# Altium project Gator Stream Transmitter.PrjPCB
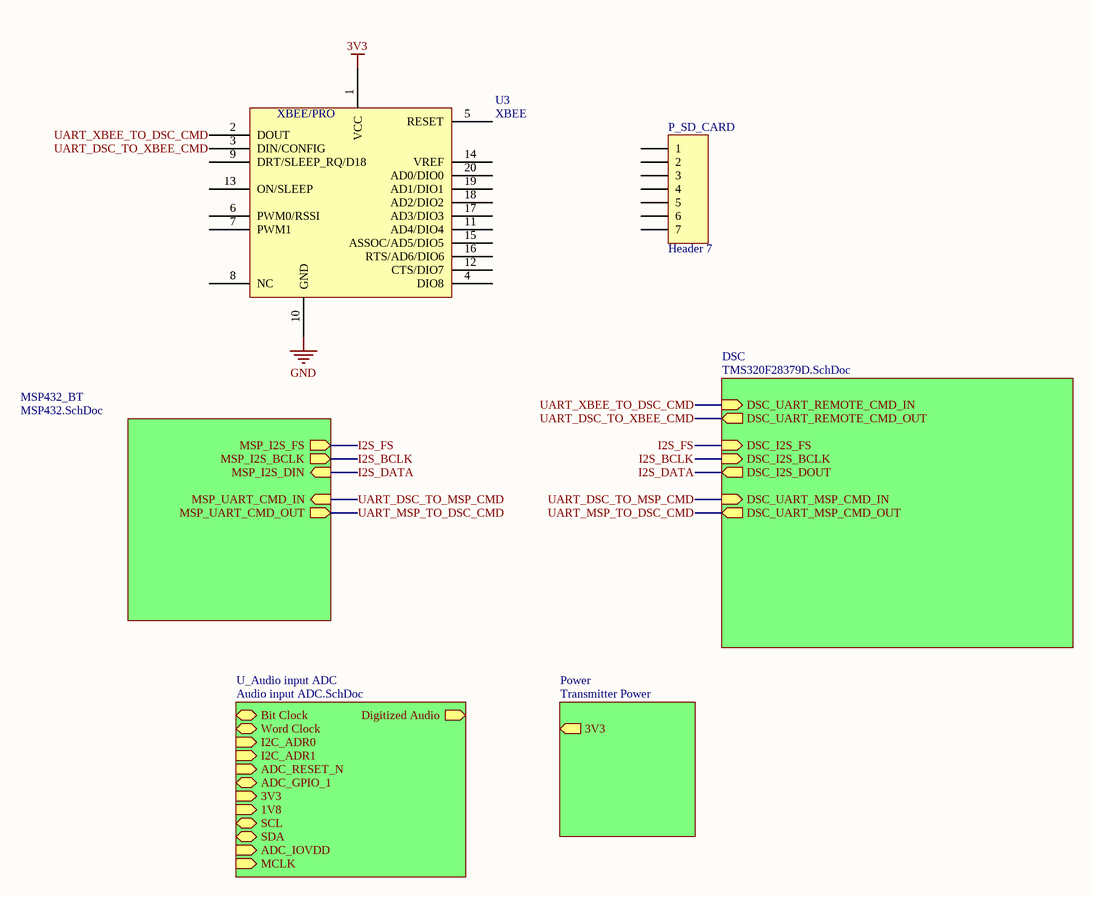
[diagram p0: Gator Stream Transmitter Sheet.SchDoc]
3 sheets, 18 parts. Net scope: hierarchical (ports join the sheet entries above them; power ports are global).
Board file: Gator Stream Transmitter.PcbDoc
Sheets:
  Gator Stream Transmitter Sheet.SchDoc
    MSP432_BT = MSP432.SchDoc
    DSC = TMS320F28379D.SchDoc

## Sheet Gator Stream Transmitter Sheet.SchDoc
size Letter

### Parts
P_SD_CARD  Header 7  [HDR1X7]
U3  XBEE  [XBEE/PRO]

### Sub-sheets
DSC = TMS320F28379D.SchDoc: DSC_I2S_FS (in), DSC_UART_MSP_CMD_IN (in), DSC_UART_MSP_CMD_OUT (out), DSC_I2S_DOUT (out), DSC_I2S_BCLK (in), DSC_UART_REMOTE_CMD_IN (in), DSC_UART_REMOTE_CMD_OUT (out)
MSP432_BT = MSP432.SchDoc: MSP_I2S_FS (out), MSP_I2S_DIN (in), MSP_UART_CMD_OUT (out), MSP_UART_CMD_IN (in), MSP_I2S_BCLK (out)
Power = Transmitter Power (file not in this document): 3V3 (out)
U_Audio input ADC = Audio input ADC.SchDoc (file not in this document): Digitized Audio (out), Bit Clock (bidir), Word Clock (bidir), I2C_ADR0 (in), I2C_ADR1 (in), ADC_RESET_N (in), ADC_GPIO_1 (bidir), 3V3 (in), 1V8 (in), SCL (bidir), SDA (bidir), ADC_IOVDD (in), MCLK (in)

### Nets
3V3: U3.1(VCC)
GND: U3.10(GND)
I2S_BCLK: sheet MSP432_BT/MSP_I2S_BCLK, sheet DSC/DSC_I2S_BCLK  [project net BT_I2S_BCLK]
I2S_DATA: sheet MSP432_BT/MSP_I2S_DIN, sheet DSC/DSC_I2S_DOUT  [project net BT_I2S_DIN]
I2S_FS: sheet MSP432_BT/MSP_I2S_FS, sheet DSC/DSC_I2S_FS  [project net BT_I2S_FS]
UART_DSC_TO_MSP_CMD: sheet MSP432_BT/MSP_UART_CMD_IN, sheet DSC/DSC_UART_MSP_CMD_IN  [project net UART_DSC_MSP_OUT]
UART_DSC_TO_XBEE_CMD: U3.3(DIN/CONFIG) ; sheet DSC/DSC_UART_REMOTE_CMD_OUT
UART_MSP_TO_DSC_CMD: sheet MSP432_BT/MSP_UART_CMD_OUT, sheet DSC/DSC_UART_MSP_CMD_OUT  [project net UART_DSC_MSP_IN]
UART_XBEE_TO_DSC_CMD: U3.2(DOUT) ; sheet DSC/DSC_UART_REMOTE_CMD_IN

Not connected (* = marked no-connect by the designer): P_SD_CARD 1 2 3 4 5 6 7; U3 4(DIO8) 5(RESET) 6(PWM0/RSSI) 7(PWM1) 8(NC) 9(DRT/SLEEP_RQ/D18) 11(AD4/DIO4) 12(CTS/DIO7) 13(ON/SLEEP) 14(VREF) 15(ASSOC/AD5/DIO5) 16(RTS/AD6/DIO6) 17(AD3/DIO3) 18(AD2/DIO2) 19(AD1/DIO1) 20(AD0/DIO0)

### Notes on the sheet
- (in symbol XBEE) XBEE/PRO

### Library data of the parts
P_SD_CARD = Header 7: Header, 7-Pin; LatestRevisionDate: 17-Jul-2002; LatestRevisionNote: Re-released for DXP Platform.; Publisher: Altium Limited

## Sheet MSP432.SchDoc
size Letter
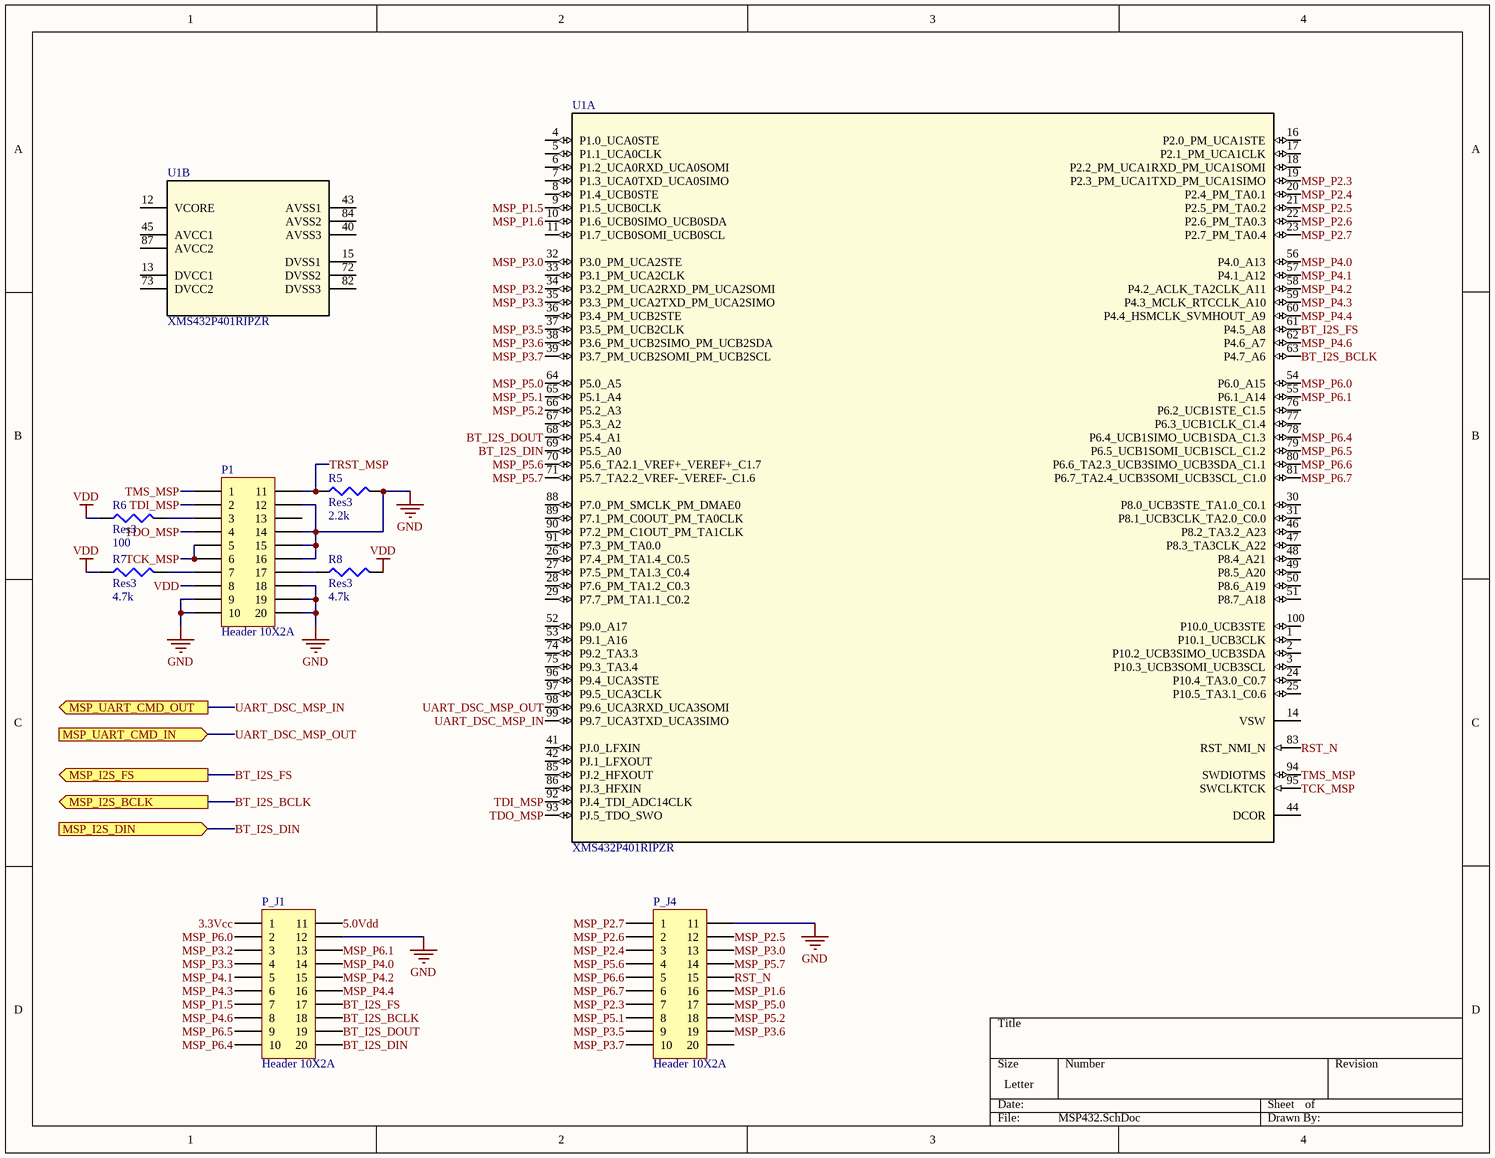
[diagram p1: MSP432.SchDoc]

### Parts
P1  Header 10X2A  [HDR2X10_CEN]
P_J1  Header 10X2A  [HDR2X10_CEN]
P_J4  Header 10X2A  [HDR2X10_CEN]
R5  Res3  value 2.2k  [J1-0603]
R6  Res3  value 100  [J1-0603]
R7  Res3  value 4.7k  [J1-0603]
R8  Res3  value 4.7k  [J1-0603]
U1  XMS432P401RIPZR  [PZ0100A_N]  (parts A,B of 2)

### Ports
MSP_I2S_BCLK (out), MSP_I2S_DIN (in), MSP_I2S_FS (out), MSP_UART_CMD_IN (in), MSP_UART_CMD_OUT (out)

### Nets
GND: P1.9 P1.10 P1.12 P1.14 P1.15 P1.16 P1.18 P1.19 P1.20 P_J1.12 P_J4.11 R5.2
VDD: P1.8 R6.1 R7.1 R8.2
3.3Vcc: P_J1.1
5.0Vdd: P_J1.11
BT_I2S_BCLK: P_J1.18 U1.63(P4.7_A6) ; port MSP_I2S_BCLK
BT_I2S_DIN: P_J1.20 U1.69(P5.5_A0) ; port MSP_I2S_DIN
BT_I2S_DOUT: P_J1.19 U1.68(P5.4_A1)
BT_I2S_FS: P_J1.17 U1.61(P4.5_A8) ; port MSP_I2S_FS
MSP_P1.5: P_J1.7 U1.9(P1.5_UCB0CLK)
MSP_P1.6: P_J4.16 U1.10(P1.6_UCB0SIMO_UCB0SDA)
MSP_P2.3: P_J4.7 U1.19(P2.3_PM_UCA1TXD_PM_UCA1SIMO)
MSP_P2.4: P_J4.3 U1.20(P2.4_PM_TA0.1)
MSP_P2.5: P_J4.12 U1.21(P2.5_PM_TA0.2)
MSP_P2.6: P_J4.2 U1.22(P2.6_PM_TA0.3)
MSP_P2.7: P_J4.1 U1.23(P2.7_PM_TA0.4)
MSP_P3.0: P_J4.13 U1.32(P3.0_PM_UCA2STE)
MSP_P3.2: P_J1.3 U1.34(P3.2_PM_UCA2RXD_PM_UCA2SOMI)
MSP_P3.3: P_J1.4 U1.35(P3.3_PM_UCA2TXD_PM_UCA2SIMO)
MSP_P3.5: P_J4.9 U1.37(P3.5_PM_UCB2CLK)
MSP_P3.6: P_J4.19 U1.38(P3.6_PM_UCB2SIMO_PM_UCB2SDA)
MSP_P3.7: P_J4.10 U1.39(P3.7_PM_UCB2SOMI_PM_UCB2SCL)
MSP_P4.0: P_J1.14 U1.56(P4.0_A13)
MSP_P4.1: P_J1.5 U1.57(P4.1_A12)
MSP_P4.2: P_J1.15 U1.58(P4.2_ACLK_TA2CLK_A11)
MSP_P4.3: P_J1.6 U1.59(P4.3_MCLK_RTCCLK_A10)
MSP_P4.4: P_J1.16 U1.60(P4.4_HSMCLK_SVMHOUT_A9)
MSP_P4.6: P_J1.8 U1.62(P4.6_A7)
MSP_P5.0: P_J4.17 U1.64(P5.0_A5)
MSP_P5.1: P_J4.8 U1.65(P5.1_A4)
MSP_P5.2: P_J4.18 U1.66(P5.2_A3)
MSP_P5.6: P_J4.4 U1.70(P5.6_TA2.1_VREF+_VEREF+_C1.7)
MSP_P5.7: P_J4.14 U1.71(P5.7_TA2.2_VREF-_VEREF-_C1.6)
MSP_P6.0: P_J1.2 U1.54(P6.0_A15)
MSP_P6.1: P_J1.13 U1.55(P6.1_A14)
MSP_P6.4: P_J1.10 U1.78(P6.4_UCB1SIMO_UCB1SDA_C1.3)
MSP_P6.5: P_J1.9 U1.79(P6.5_UCB1SOMI_UCB1SCL_C1.2)
MSP_P6.6: P_J4.5 U1.80(P6.6_TA2.3_UCB3SIMO_UCB3SDA_C1.1)
MSP_P6.7: P_J4.6 U1.81(P6.7_TA2.4_UCB3SOMI_UCB3SCL_C1.0)
RST_N: P_J4.15 U1.83(RST_NMI_N)
TCK_MSP: P1.5 P1.6 U1.95(SWCLKTCK)
TDI_MSP: P1.2 U1.92(PJ.4_TDI_ADC14CLK)
TDO_MSP: P1.4 U1.93(PJ.5_TDO_SWO)
TMS_MSP: P1.1 U1.94(SWDIOTMS)
TRST_MSP: P1.11 R5.1
UART_DSC_MSP_IN: U1.99(P9.7_UCA3TXD_UCA3SIMO) ; port MSP_UART_CMD_OUT
UART_DSC_MSP_OUT: U1.98(P9.6_UCA3RXD_UCA3SOMI) ; port MSP_UART_CMD_IN
NetP1_3: P1.3 R6.2
NetP1_7: P1.7 R7.2
NetP1_17: P1.17 R8.1

Not connected (* = marked no-connect by the designer): P1 13; P_J4 20; U1 1(P10.1_UCB3CLK) 2(P10.2_UCB3SIMO_UCB3SDA) 3(P10.3_UCB3SOMI_UCB3SCL) 4(P1.0_UCA0STE) 5(P1.1_UCA0CLK) 6(P1.2_UCA0RXD_UCA0SOMI) 7(P1.3_UCA0TXD_UCA0SIMO) 8(P1.4_UCB0STE) 11(P1.7_UCB0SOMI_UCB0SCL) 12(VCORE) 13(DVCC1) 14(VSW) 15(DVSS1) 16(P2.0_PM_UCA1STE) 17(P2.1_PM_UCA1CLK) 18(P2.2_PM_UCA1RXD_PM_UCA1SOMI) 24(P10.4_TA3.0_C0.7) 25(P10.5_TA3.1_C0.6) 26(P7.4_PM_TA1.4_C0.5) 27(P7.5_PM_TA1.3_C0.4) 28(P7.6_PM_TA1.2_C0.3) 29(P7.7_PM_TA1.1_C0.2) 30(P8.0_UCB3STE_TA1.0_C0.1) 31(P8.1_UCB3CLK_TA2.0_C0.0) 33(P3.1_PM_UCA2CLK) 36(P3.4_PM_UCB2STE) 40(AVSS3) 41(PJ.0_LFXIN) 42(PJ.1_LFXOUT) 43(AVSS1) 44(DCOR) 45(AVCC1) 46(P8.2_TA3.2_A23) 47(P8.3_TA3CLK_A22) 48(P8.4_A21) 49(P8.5_A20) 50(P8.6_A19) 51(P8.7_A18) 52(P9.0_A17) 53(P9.1_A16) 67(P5.3_A2) 72(DVSS2) 73(DVCC2) 74(P9.2_TA3.3) 75(P9.3_TA3.4) 76(P6.2_UCB1STE_C1.5) 77(P6.3_UCB1CLK_C1.4) 82(DVSS3) 84(AVSS2) 85(PJ.2_HFXOUT) 86(PJ.3_HFXIN) 87(AVCC2) 88(P7.0_PM_SMCLK_PM_DMAE0) 89(P7.1_PM_C0OUT_PM_TA0CLK) 90(P7.2_PM_C1OUT_PM_TA1CLK) 91(P7.3_PM_TA0.0) 96(P9.4_UCA3STE) 97(P9.5_UCA3CLK) 100(P10.0_UCB3STE)

### Library data of the parts
P1 P_J1 P_J4 = Header 10X2A: Header, 10-Pin, Dual row; LatestRevisionDate: 17-Jul-2002; LatestRevisionNote: Re-released for DXP Platform.; Publisher: Altium Limited
R5-R8 = Res3: Resistor; Published: 8-Jun-2000; LatestRevisionDate: 29-May-2009; LatestRevisionNote: IPC-7351 Footprint Added.; PackageReference: J1-0603; Publisher: Altium Limited; PackageDescription: Chip Resistor
U1 = XMS432P401RIPZR: Imported; Manufacturer: Texas Instruments; CompType: IC; PIN_COUNT: 100; PartNumber: XMS432P401RIPZR; PackageReference: PZ0100A; MountType: SMT; RefDes: RefDes; TYPE: TYPE; Value: Value

## Sheet TMS320F28379D.SchDoc
size Letter
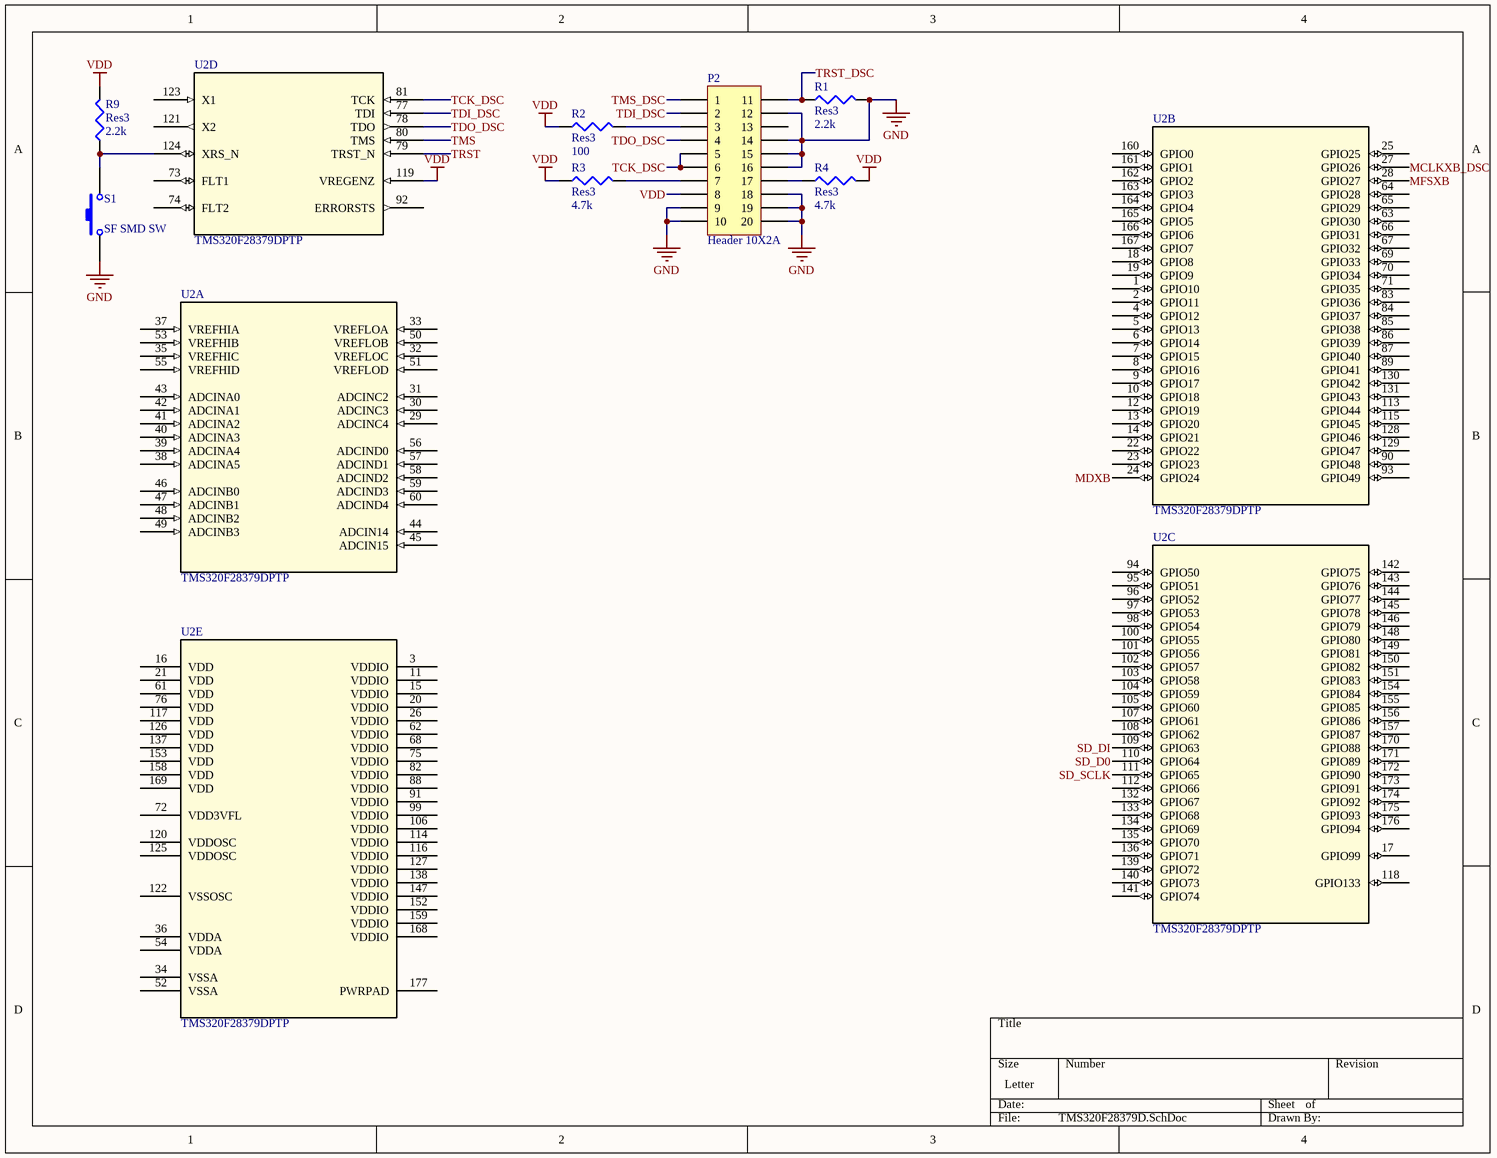
[diagram p2: TMS320F28379D.SchDoc]

### Parts
P2  Header 10X2A  [HDR2X10_CEN]
R1  Res3  value 2.2k  [J1-0603]
R2  Res3  value 100  [J1-0603]
R3  Res3  value 4.7k  [J1-0603]
R4  Res3  value 4.7k  [J1-0603]
R9  Res3  value 2.2k  [J1-0603]
S1  SF SMD SW  [SW_SMD]
U2  TMS320F28379DPTP  [PTP0176F_N]  (parts A,B,C,D,E of 5)

### Nets
GND: P2.9 P2.10 P2.12 P2.14 P2.15 P2.16 P2.18 P2.19 P2.20 R1.2 S1.1
VDD: P2.8 R2.1 R3.1 R4.2 R9.2 U2.119(VREGENZ)
MCLKXB_DSC: U2.27(GPIO26)
MDXB: U2.24(GPIO24)
MFSXB: U2.28(GPIO27)
SD_D0: U2.110(GPIO64)
SD_DI: U2.109(GPIO63)
SD_SCLK: U2.111(GPIO65)
TCK_DSC: P2.5 P2.6 U2.81(TCK)
TDI_DSC: P2.2 U2.77(TDI)
TDO_DSC: P2.4 U2.78(TDO)
TMS: U2.80(TMS)
TMS_DSC: P2.1
TRST: U2.79(TRST_N)
TRST_DSC: P2.11 R1.1
NetP2_3: P2.3 R2.2
NetP2_7: P2.7 R3.2
NetP2_17: P2.17 R4.1
NetR9_1: R9.1 S1.2 U2.124(XRS_N)

Not connected (* = marked no-connect by the designer): P2 13; U2 1(GPIO10) 2(GPIO11) 3(VDDIO) 4(GPIO12) 5(GPIO13) 6(GPIO14) 7(GPIO15) 8(GPIO16) 9(GPIO17) 10(GPIO18) 11(VDDIO) 12(GPIO19) 13(GPIO20) 14(GPIO21) 15(VDDIO) 16(VDD) 17(GPIO99) 18(GPIO8) 19(GPIO9) 20(VDDIO) 21(VDD) 22(GPIO22) 23(GPIO23) 25(GPIO25) 26(VDDIO) 29(ADCINC4) 30(ADCINC3) 31(ADCINC2) 32(VREFLOC) 33(VREFLOA) 34(VSSA) 35(VREFHIC) 36(VDDA) 37(VREFHIA) 38(ADCINA5) 39(ADCINA4) 40(ADCINA3) 41(ADCINA2) 42(ADCINA1) 43(ADCINA0) 44(ADCIN14) 45(ADCIN15) 46(ADCINB0) 47(ADCINB1) 48(ADCINB2) 49(ADCINB3) 50(VREFLOB) 51(VREFLOD) 52(VSSA) 53(VREFHIB) 54(VDDA) 55(VREFHID) 56(ADCIND0) 57(ADCIND1) 58(ADCIND2) 59(ADCIND3) 60(ADCIND4) 61(VDD) 62(VDDIO) 63(GPIO30) 64(GPIO28) 65(GPIO29) 66(GPIO31) 67(GPIO32) 68(VDDIO) 69(GPIO33) 70(GPIO34) 71(GPIO35) 72(VDD3VFL) 73(FLT1) 74(FLT2) 75(VDDIO) 76(VDD) 82(VDDIO) 83(GPIO36) 84(GPIO37) 85(GPIO38) 86(GPIO39) 87(GPIO40) 88(VDDIO) 89(GPIO41) 90(GPIO48) 91(VDDIO) 92(ERRORSTS) 93(GPIO49) 94(GPIO50) 95(GPIO51) 96(GPIO52) 97(GPIO53) 98(GPIO54) 99(VDDIO) 100(GPIO55) 101(GPIO56) 102(GPIO57) 103(GPIO58) 104(GPIO59) 105(GPIO60) 106(VDDIO) 107(GPIO61) 108(GPIO62) 112(GPIO66) 113(GPIO44) 114(VDDIO) 115(GPIO45) 116(VDDIO) 117(VDD) 118(GPIO133) 120(VDDOSC) 121(X2) 122(VSSOSC) 123(X1) 125(VDDOSC) 126(VDD) 127(VDDIO) 128(GPIO46) 129(GPIO47) 130(GPIO42) 131(GPIO43) 132(GPIO67) 133(GPIO68) 134(GPIO69) 135(GPIO70) 136(GPIO71) 137(VDD) 138(VDDIO) 139(GPIO72) 140(GPIO73) 141(GPIO74) 142(GPIO75) 143(GPIO76) 144(GPIO77) 145(GPIO78) 146(GPIO79) 147(VDDIO) 148(GPIO80) 149(GPIO81) 150(GPIO82) 151(GPIO83) 152(VDDIO) 153(VDD) 154(GPIO84) 155(GPIO85) 156(GPIO86) 157(GPIO87) 158(VDD) 159(VDDIO) 160(GPIO0) 161(GPIO1) 162(GPIO2) 163(GPIO3) 164(GPIO4) 165(GPIO5) 166(GPIO6) 167(GPIO7) 168(VDDIO) 169(VDD) 170(GPIO88) 171(GPIO89) 172(GPIO90) 173(GPIO91) 174(GPIO92) 175(GPIO93) 176(GPIO94) 177(PWRPAD)

### Library data of the parts
P2 = Header 10X2A: Header, 10-Pin, Dual row; LatestRevisionDate: 17-Jul-2002; LatestRevisionNote: Re-released for DXP Platform.; Publisher: Altium Limited
R1-R4 R9 = Res3: Resistor; Published: 8-Jun-2000; LatestRevisionDate: 29-May-2009; LatestRevisionNote: IPC-7351 Footprint Added.; PackageReference: J1-0603; Publisher: Altium Limited; PackageDescription: Chip Resistor
S1 = SW-PB_1: DIGIKEY SW400-ND; Published: 24-Mar-1999; LatestRevisionDate: 17-Jul-2002; LatestRevisionNote: Re-released for DXP Platform.; Publisher: Altium Limited
U2 = TMS320F28379DPTP: Imported; PartNumber: TMS320F28379DPTPS; Manufacturer: Texas Instruments; RefDes: RefDes; TYPE: TYPE; Value: Value

## Nets that join several sheets
GND: Gator Stream Transmitter Sheet (U3.10), MSP432 (12 pins), TMS320F28379D (11 pins)
VDD: MSP432 (P1.8 R6.1 R7.1 R8.2), TMS320F28379D (6 pins)